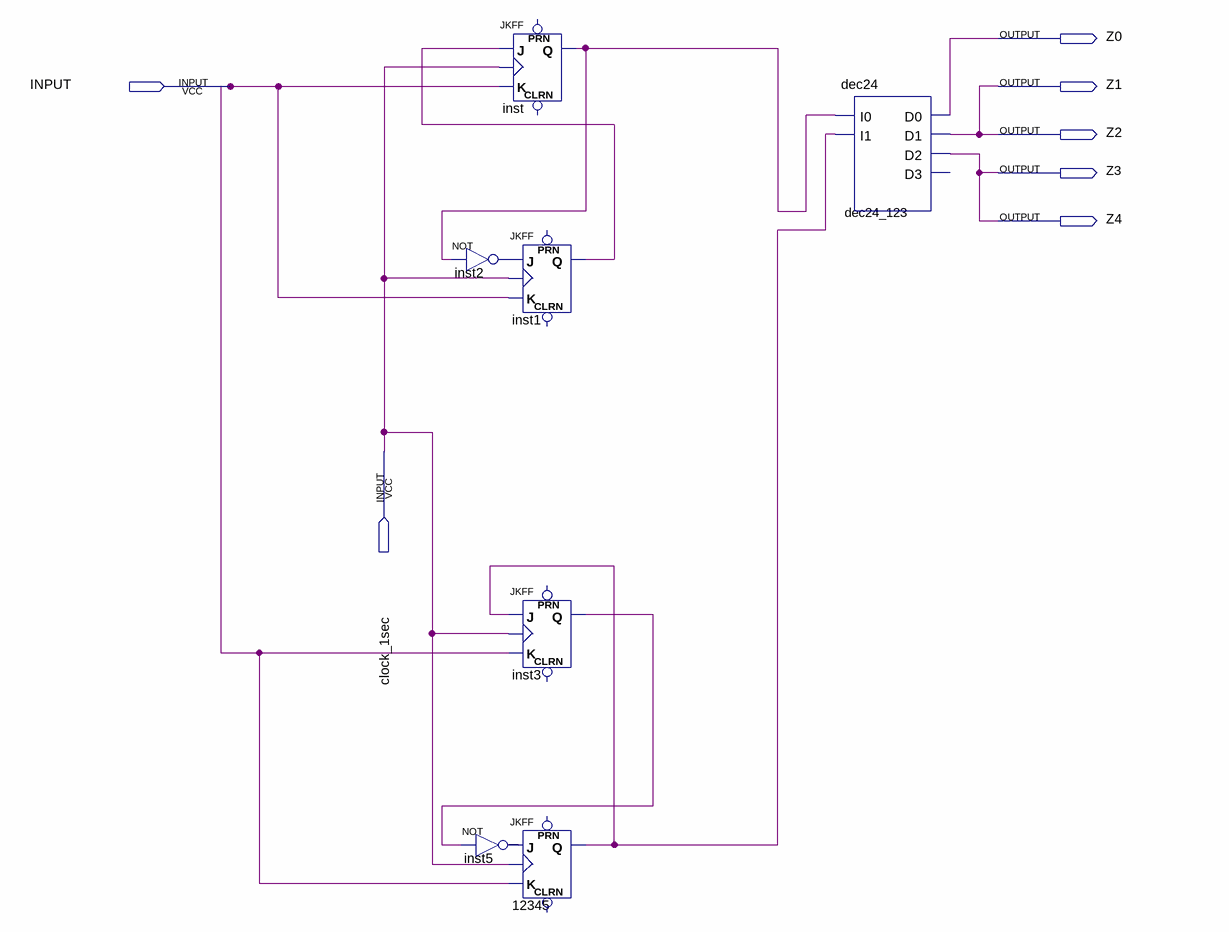
[diagram p0: schematic sheet]
// Quartus schematic mj_head_hit.bdf as structural Verilog: 7 symbols, 7 pins
module mj_head_hit (
  input  INPUT,
  input  clock_1sec,
  output Z0,
  output Z1,
  output Z2,
  output Z3,
  output Z4
);

  wire inst1_q, inst2_out, inst3_q, inst5_out, inst_q, n12345_q;

  JKFF inst (.K(INPUT), .J(inst1_q), .CLK(clock_1sec), .Q(inst_q));  // open: PRN, CLRN
  JKFF inst1 (.K(INPUT), .J(inst2_out), .CLK(clock_1sec), .Q(inst1_q));  // open: PRN, CLRN
  not inst2 (inst2_out, inst_q);
  JKFF inst3 (.K(INPUT), .J(n12345_q), .CLK(clock_1sec), .Q(inst3_q));  // open: PRN, CLRN
  JKFF u_12345 (.K(INPUT), .J(inst5_out), .CLK(clock_1sec), .Q(n12345_q));  // open: PRN, CLRN
  not inst5 (inst5_out, inst3_q);
  dec24 dec24_123 (.I0(inst_q), .I1(n12345_q), .D0(Z0), .D1(Z1), .D2(Z3));  // open: D3

  assign Z2 = Z1;
  assign Z4 = Z3;
endmodule
